# EAGLE schematic MUDE - analogMux (EAGLE 7.3.0)
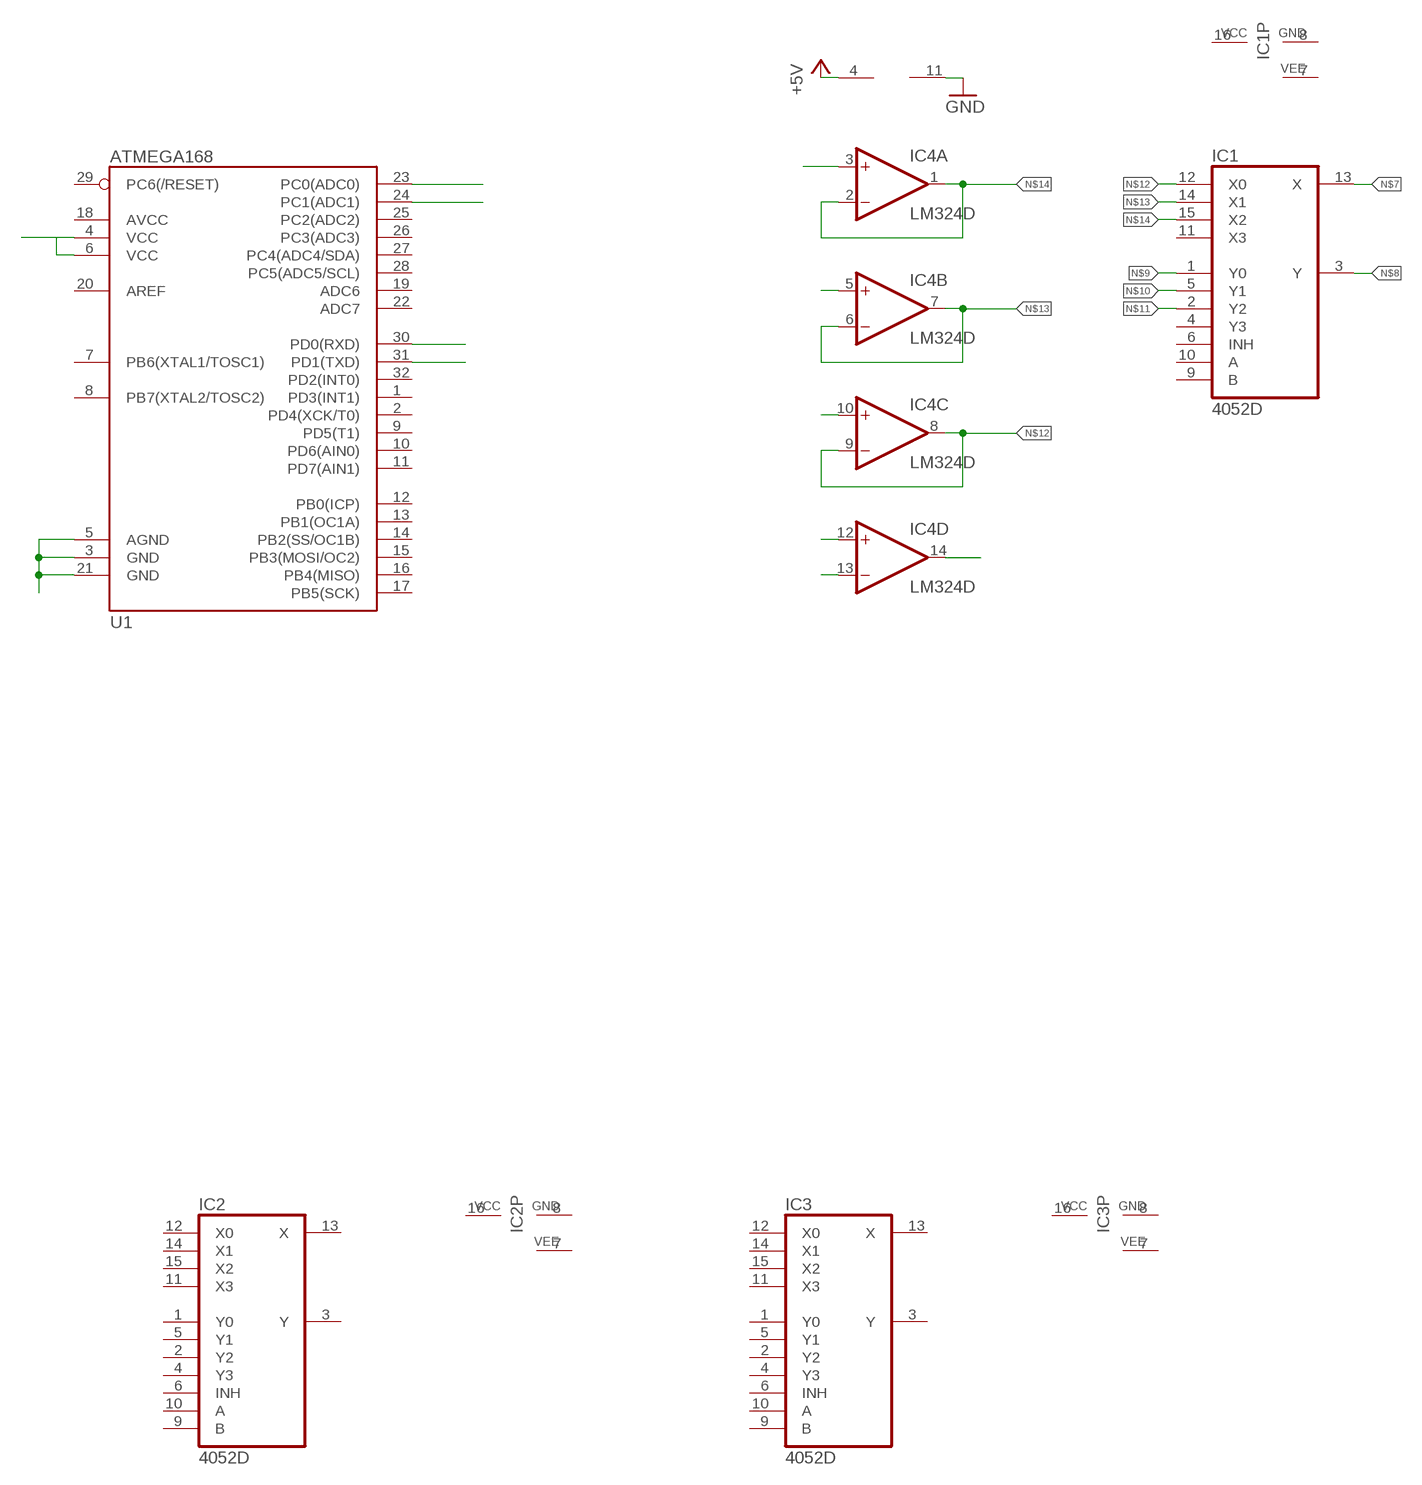
[diagram p0: schematic, sheet 1]

## Parts
IC1  4052D  [SO16]
IC2  4052D  [SO16]
IC3  4052D  [SO16]
IC4  LM324D  [SO14]
U1  ATMEGA168  [TQFP32-08]

## Nets
+5V: IC4.4(P:V+)
GND: IC4.11(P:V-)
N$1: U1.23(PC0(ADC0))
N$2: U1.24(PC1(ADC1))
N$3: U1.3(GND) U1.5(AGND) U1.21(GND)
N$4: U1.4(VCC) U1.6(VCC)
N$5: U1.30(PD0(RXD))
N$6: U1.31(PD1(TXD))
N$7: IC1.13(X)
N$8: IC1.3(Y)
N$9: IC1.1(Y0)
N$10: IC1.5(Y1)
N$11: IC1.2(Y2)
N$12: IC1.12(X0) IC4.8(C:OUT) IC4.9(C:-IN)
N$13: IC1.14(X1) IC4.6(B:-IN) IC4.7(B:OUT)
N$14: IC1.15(X2) IC4.1(A:OUT) IC4.2(A:-IN)
N$15: IC4.14(D:OUT)
N$16: IC4.3(A:+IN)
N$19: IC4.13(D:-IN)
N$20: IC4.10(C:+IN)
N$21: IC4.5(B:+IN)
N$22: IC4.12(D:+IN)
Unconnected: IC1.4(Y3) IC1.6(INH) IC1.9(B) IC1.10(A) IC1.11(X3) IC2.1(Y0) IC2.2(Y2) IC2.3(Y) IC2.4(Y3) IC2.5(Y1) IC2.6(INH) IC2.9(B) IC2.10(A) IC2.11(X3) IC2.12(X0) IC2.13(X) IC2.14(X1) IC2.15(X2) IC3.1(Y0) IC3.2(Y2) IC3.3(Y) IC3.4(Y3) IC3.5(Y1) IC3.6(INH) IC3.9(B) IC3.10(A) IC3.11(X3) IC3.12(X0) IC3.13(X) IC3.14(X1) IC3.15(X2) U1.1(PD3(INT1)) U1.2(PD4(XCK/T0)) U1.7(PB6(XTAL1/TOSC1)) U1.8(PB7(XTAL2/TOSC2)) U1.9(PD5(T1)) U1.10(PD6(AIN0)) U1.11(PD7(AIN1)) U1.12(PB0(ICP)) U1.13(PB1(OC1A)) U1.14(PB2(SS/OC1B)) U1.15(PB3(MOSI/OC2)) U1.16(PB4(MISO)) U1.17(PB5(SCK)) U1.18(AVCC) U1.19(ADC6) U1.20(AREF) U1.22(ADC7) U1.25(PC2(ADC2)) U1.26(PC3(ADC3)) U1.27(PC4(ADC4/SDA)) U1.28(PC5(ADC5/SCL)) U1.29(PC6(/RESET)) U1.32(PD2(INT0))

## Power pins joined to a net without a drawn wire
GND: IC1.8(GND) IC2.8(GND) IC3.8(GND)
VCC: IC1.16(VCC) IC2.16(VCC) IC3.16(VCC)
VEE: IC1.7(VEE) IC2.7(VEE) IC3.7(VEE)

## Library data of the parts
IC1-IC3 = 40xx:4052: Dual 4-channel ANALOG MULTIPLEXER
IC4 = linear:LM324: OP AMP
U1 = SparkFun-DigitalIC:ATMEGA168: Atmel 32-pin 8-bit micro, 16k flash.